# Altium schematic sheet interlock.SchDoc
size A3; DocumentNumber: 14; SheetNumber: 14; SheetTotal: 45; SheetDescription: Interlock Circuit
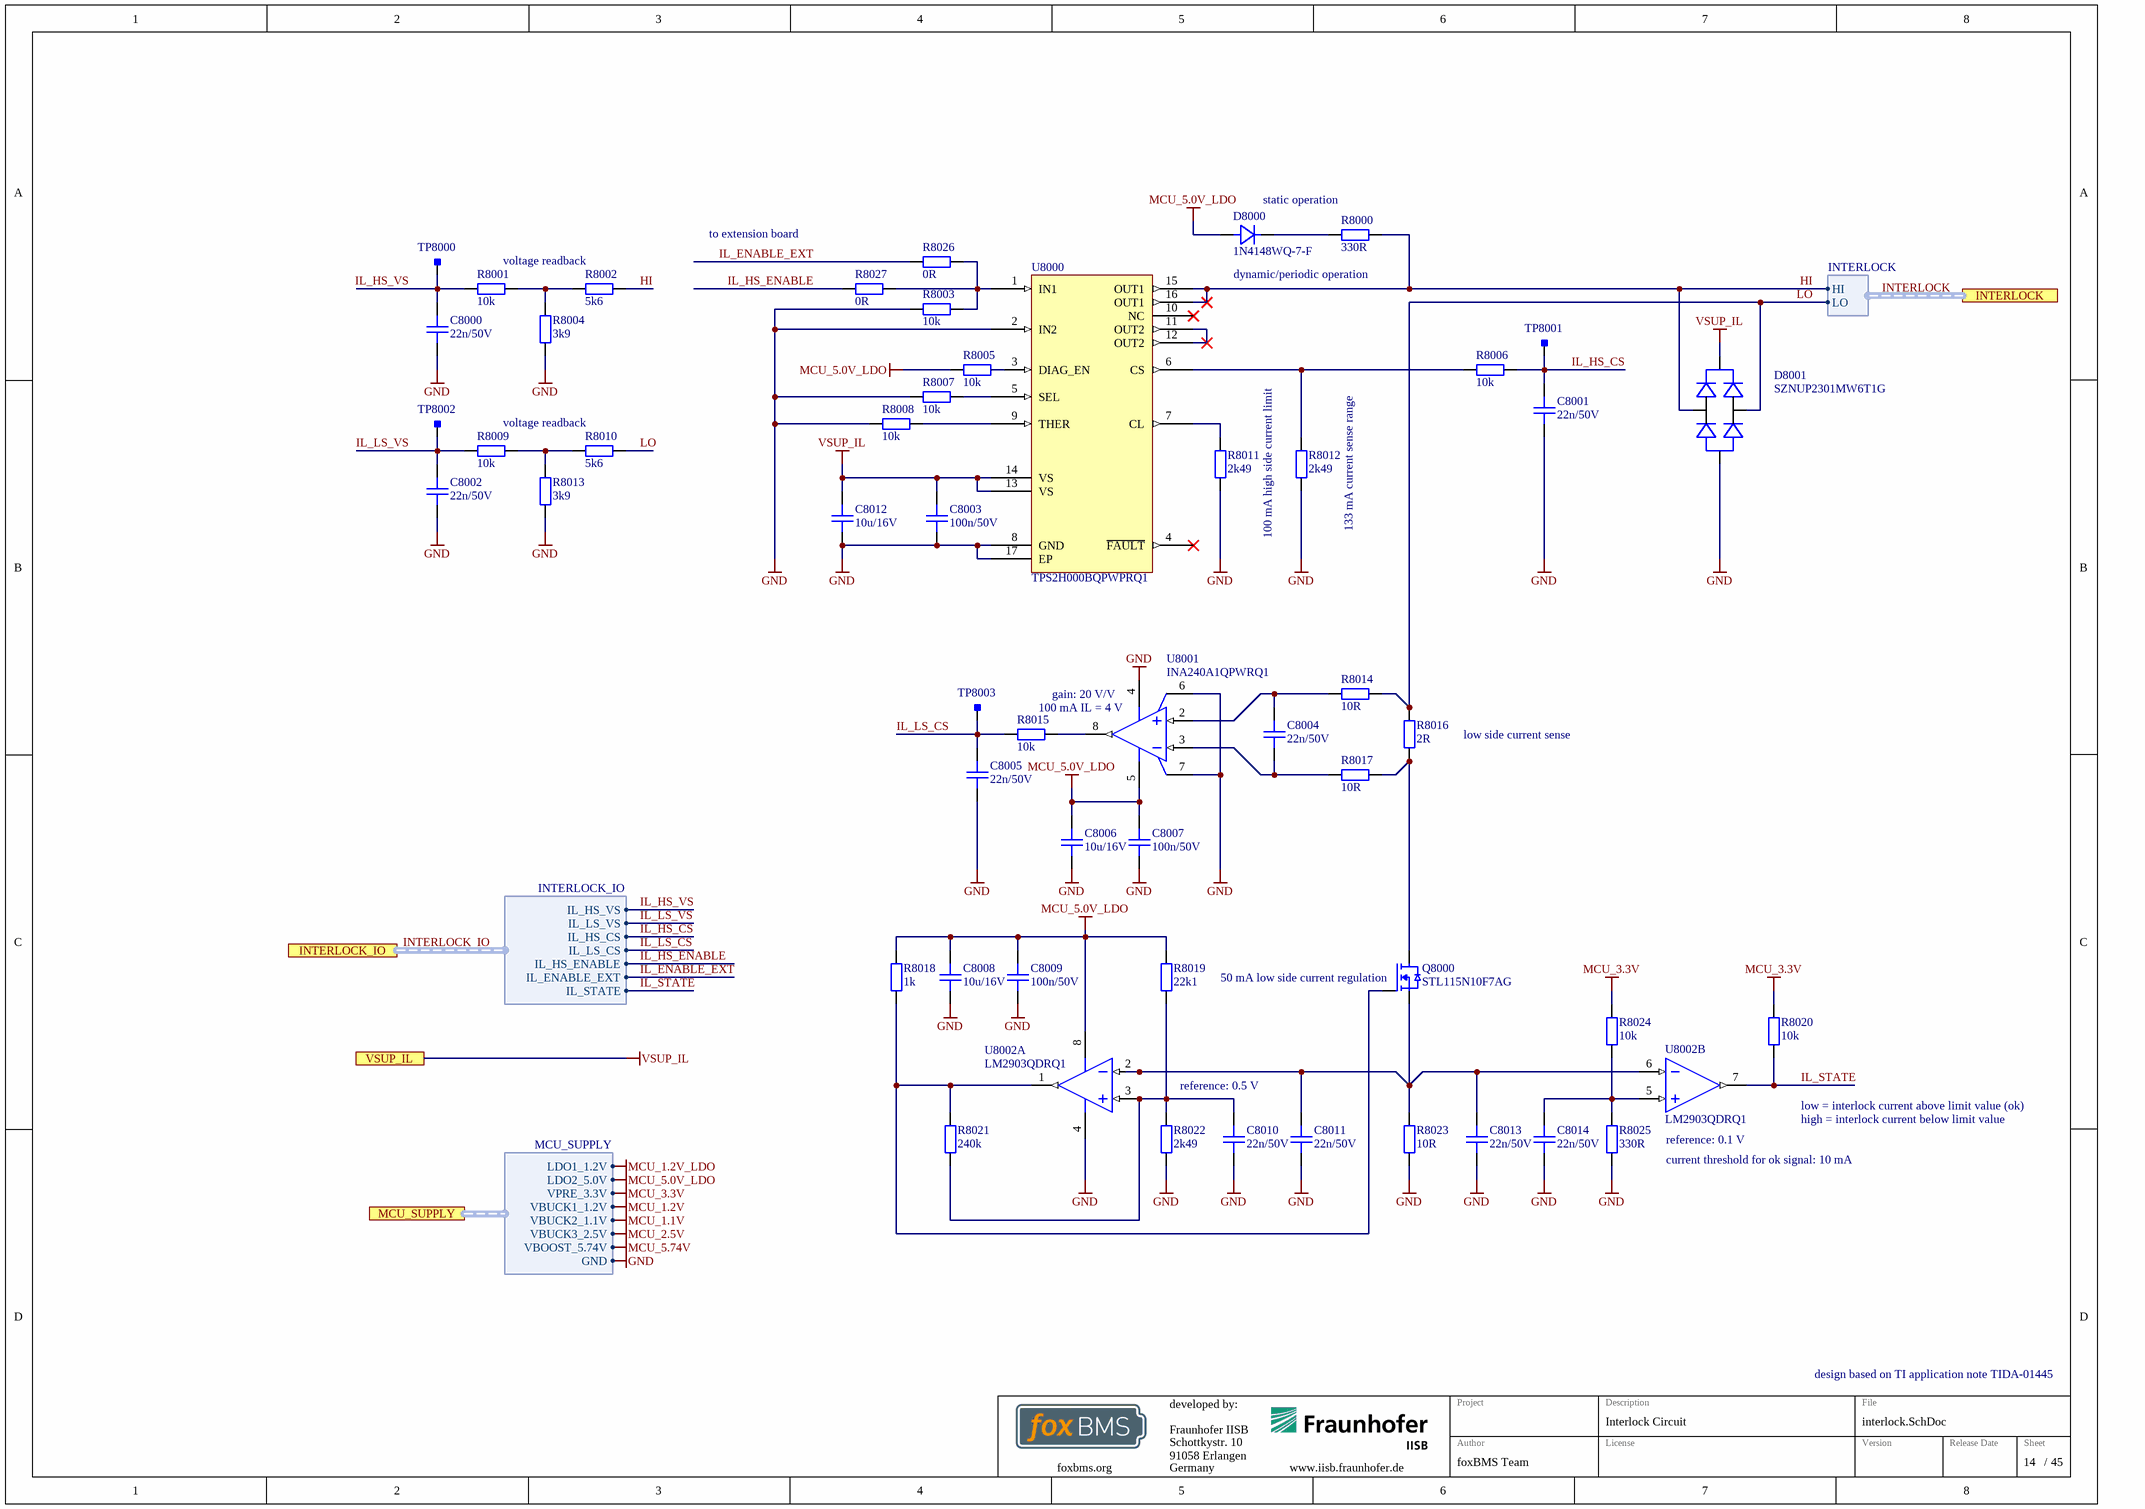
[diagram p0: interlock.SchDoc]

## Parts
C8000  22n/50V  [CAPC1005X06N]
C8001  22n/50V  [CAPC1005X06N]
C8002  22n/50V  [CAPC1005X06N]
C8003  100n/50V  [CAPC1005X06N]
C8004  22n/50V  [CAPC1005X06N]
C8005  22n/50V  [CAPC1005X06N]
C8006  10u/16V  [CAPC2012X14N]
C8007  100n/50V  [CAPC1005X06N]
C8008  10u/16V  [CAPC2012X14N]
C8009  100n/50V  [CAPC1005X06N]
C8010  22n/50V  [CAPC1005X06N]
C8011  22n/50V  [CAPC1005X06N]
C8012  10u/16V  [CAPC2012X14N]
C8013  22n/50V  [CAPC1005X06N]
C8014  22n/50V  [CAPC1005X06N]
D8000  1N4148WQ-7-F  [SOD-123_CASE-425-04-ISSUE-G]
D8001  SZNUP2301MW6T1G  [ONSEMI_SC-88_SOT-363]
Q8000  STL115N10F7AG  [ST_PowerFLAT_5x6_WF_type_C]
R8000  330R  [RESC1608X05N]
R8001  10k  [RESC1005X04N]
R8002  5k6  [RESC1005X04N]
R8003  10k  [RESC1005X04N]
R8004  3k9  [RESC1005X04N]
R8005  10k  [RESC1005X04N]
R8006  10k  [RESC1005X04N]
R8007  10k  [RESC1005X04N]
R8008  10k  [RESC1005X04N]
R8009  10k  [RESC1005X04N]
R8010  5k6  [RESC1005X04N]
R8011  2k49  [RESC1005X04N]
R8012  2k49  [RESC1005X04N]
R8013  3k9  [RESC1005X04N]
R8014  10R  [RESC1005X04N]
R8015  10k  [RESC1005X04N]
R8016  2R  [RESC2012X05N]
R8017  10R  [RESC1005X04N]
R8018  1k  [RESC1005X04N]
R8019  22k1  [RESC1005X04N]
R8020  10k  [RESC1005X04N]
R8021  240k  [RESC1005X04N]
R8022  2k49  [RESC1005X04N]
R8023  10R  [RESC2012X05N]
R8024  10k  [RESC1005X04N]
R8025  330R  [RESC1005X04N]
R8026  0R  [RESC1005X04N]
R8027  0R  [RESC1005X04N]
TP8000  Testpoint_Square  [Testpoint_S1]  (value not drawn)  (no BOM)
TP8001  Testpoint_Square  [Testpoint_S1]  (value not drawn)  (no BOM)
TP8002  Testpoint_Square  [Testpoint_S1]  (value not drawn)  (no BOM)
TP8003  Testpoint_Square  [Testpoint_S1]  (value not drawn)  (no BOM)
U8000  TPS2H000BQPWPRQ1  [TI_PWP0016J]
U8001  INA240A1QPWRQ1  [TI_PW0008A]
U8002  LM2903QDRQ1  [TI_D0008A]  (parts A,B of 2)

## Ports
INTERLOCK (harness INTERLOCK), INTERLOCK_IO (harness INTERLOCK_IO), MCU_SUPPLY (harness MCU_SUPPLY), VSUP_IL

## Harnesses
INTERLOCK: HI, LO
INTERLOCK_IO: IL_HS_CS, IL_LS_CS, IL_HS_VS, IL_LS_VS, IL_HS_ENABLE, IL_STATE, IL_ENABLE_EXT
MCU_SUPPLY: VBUCK1_1.2V, VBUCK2_1.1V, VBUCK3_2.5V, LDO1_1.2V, LDO2_5.0V, GND, VPRE_3.3V, VBOOST_5.74V

## Nets
GND: C8000.1 C8001.1 C8002.1 C8003.1 C8005.1 C8006.1 C8007.1 C8008.1 C8009.1 C8010.1 C8011.2 C8012.1 C8013.2 C8014.1 D8001.1(Anode) R8003.2 R8004.1 R8007.2 R8008.2 R8011.2 R8012.2 R8013.1 R8022.1 R8023.2 R8025.1 U8000.2(IN2) U8000.8(GND) U8000.17(EP) U8001.4(-VS) U8001.6(REF2) U8001.7(REF1) U8002.4(GND) ; port MCU_SUPPLY.GND
MCU_1.1V: port MCU_SUPPLY.VBUCK2_1.1V
MCU_1.2V: port MCU_SUPPLY.VBUCK1_1.2V
MCU_1.2V_LDO: port MCU_SUPPLY.LDO1_1.2V
MCU_2.5V: port MCU_SUPPLY.VBUCK3_2.5V
MCU_3.3V: R8020.1 R8024.1 ; port MCU_SUPPLY.VPRE_3.3V
MCU_5.0V_LDO: C8006.2 C8007.2 C8008.2 C8009.2 D8000.2(A) R8005.2 R8018.2 R8019.1 U8001.5(+VS) U8002.8(VCC) ; port MCU_SUPPLY.LDO2_5.0V
MCU_5.74V: port MCU_SUPPLY.VBOOST_5.74V
VSUP_IL: C8003.2 C8012.2 D8001.3(Cathode) U8000.13(VS) U8000.14(VS) ; port VSUP_IL
HI: D8001.2(Common) R8000.1 R8002.2 U8000.15(OUT1) U8000.16(OUT1) ; port INTERLOCK.HI
IL_ENABLE_EXT: R8026.1 ; port INTERLOCK_IO.IL_ENABLE_EXT
IL_HS_CS: C8001.2 R8006.1 TP8001.1 ; port INTERLOCK_IO.IL_HS_CS
IL_HS_ENABLE: R8027.1 ; port INTERLOCK_IO.IL_HS_ENABLE
IL_HS_VS: C8000.2 R8001.1 TP8000.1 ; port INTERLOCK_IO.IL_HS_VS
IL_LS_CS: C8005.2 R8015.1 TP8003.1 ; port INTERLOCK_IO.IL_LS_CS
IL_LS_VS: C8002.2 R8009.1 TP8002.1 ; port INTERLOCK_IO.IL_LS_VS
IL_STATE: R8020.2 U8002.7(2OUT) ; port INTERLOCK_IO.IL_STATE
LO: D8001.5(Common) R8010.2 R8014.2 R8016.1 ; port INTERLOCK.LO  [project net INTERLOCK.LO]
NetC8004_1: C8004.1 R8017.1 U8001.3(-IN)
NetC8004_2: C8004.2 R8014.1 U8001.2(+IN)
NetC8010_2: C8010.2 R8019.2 R8021.1 R8022.2 U8002.3(1IN+)
NetC8011_1: C8011.1 C8013.1 Q8000.S R8023.1 U8002.2(1IN-) U8002.6(2IN-)
NetC8014_2: C8014.2 R8024.2 R8025.2 U8002.5(2IN+)
NetD8000_1: D8000.1(K) R8000.2
NetQ8000_D: Q8000.D R8016.2 R8017.2
NetQ8000_G: Q8000.G R8018.1 R8021.2 U8002.1(1OUT)
NetR8001_2: R8001.2 R8002.1 R8004.2
NetR8003_1: R8003.1 R8026.2 R8027.2 U8000.1(IN1)
NetR8005_1: R8005.1 U8000.3(DIAG_EN)
NetR8006_2: R8006.2 R8012.1 U8000.6(CS)
NetR8007_1: R8007.1 U8000.5(SEL)
NetR8008_1: R8008.1 U8000.9(THER)
NetR8009_2: R8009.2 R8010.1 R8013.2
NetR8011_1: R8011.1 U8000.7(CL)
NetR8015_2: R8015.2 U8001.8(VOUT)
NetU8000_11: U8000.11(OUT2) U8000.12(OUT2)

Not connected (* = marked no-connect by the designer): U8000 4(~{FAULT})* 10(NC)*

## Buses and harness runs
harness INTERLOCK = port INTERLOCK
harness INTERLOCK_IO = port INTERLOCK_IO

## Notes on the sheet
- to extension board
- static operation
- voltage readback
- dynamic/periodic operation
- 100 mA high side current limit
- (near R8012) 133 mA current sense range
- (near U8001) 100 mA IL = 4 V
- (near U8001) gain: 20 V/V
- low side current sense
- (near Q8000) 50 mA low side current regulation
- reference: 0.5 V
- low = interlock current above limit value (ok)
- high = interlock current below limit value
- reference: 0.1 V
- current threshold for ok signal: 10 mA
- design based on TI application note TIDA-01445
- Fraunhofer IISB
- Schottkystr. 10
- developed by:
- 91058 Erlangen
- Germany
- Author
- Project
- License
- Description
- File
- Version
- Release Date
- Sheet
- foxbms.org <https://foxbms.org>
- www.iisb.fraunhofer.de <https://www.iisb.fraunhofer.de/>
- foxBMS Team
- /

## Library data of the parts
C8000-C8002 C8004 C8005 C8010 C8011 C8013 C8014 = gen_C_ceramic_22n_50V_X7R_0402: MLCC; Capacitance: 22n; Rated Voltage: 50V; Dielectric: X7R; Case EIA: 0402; Case Metric: 1005; Automotive Qualified: True; AEC-Q Norm: AEC-Q200; AEC-Q Grade: Grade 1; PnP Package: 0402C; Part Number: gen_C_ceramic_22n_50V_X7R_0402; Supplier 1: Digikey; Supplier Part Number 1: 490-4763-1-ND; ECCN: EAR99
C8003 C8007 C8009 = gen_C_ceramic_100n_50V_X7R_0402: MLCC; Capacitance: 100n; Rated Voltage: 50V; Dielectric: X7R; Case EIA: 0402; Case Metric: 1005; PnP Package: 0402C; PnP Value: 100nF/50V/X7R; PnP equipped: x; Automotive Qualified: True; AEC-Q Norm: AEC-Q200; Part Number: gen_C_ceramic_100n_50V_X7R_0402; Supplier 1: Farnell; Supplier Part Number 1: 2210822; ECCN: EAR99
C8006 C8008 C8012 = gen_C_ceramic_10u_16V_X7R_0805: MLCC; Capacitance: 10u; Rated Voltage: 16V; Dielectric: X7S; Case EIA: 0805; Case Metric: 2012; Automotive Qualified: True; AEC-Q Grade: Grade 1; AEC-Q Norm: AEC-Q200; Part Number: gen_C_ceramic_10u_16V_X7R_0805; ECCN: EAR99; Supplier 1: Digikey; Supplier Part Number 1: 445-16110-1-ND
D8000 = 1N4148WQ-7-F: Diode; Manufacturer: Diodes Inc.; Breakdown Voltage: 100V; Continuous Forward Current: 300mA; PnP Package: SOD123; Automotive Qualified: True; Part Number: 1N4148WQ-7-F; Part Name: 1N4148WQ-7-F; Operating Temperature: -65°C - +150°C; ComponentLink1Description: Datasheet; ComponentLink1URL: https://www.diodes.com/assets/Datasheets/ds30086.pdf; Supplier 1: Digikey; Supplier Part Number 1: 1N4148WQ-7-FDICT-ND
D8001 = SZNUP2301MW6T1G: TVS diode array; Manufacturer: ON Semiconductor; Breakdown Voltage: 70V; Automotive Qualified: True; AEC-Q Norm: AEC-Q101; AEC-Q Grade: Grade 0; Part Number: SZNUP2301MW6T1G; Part Name: SZNUP2301MW6T1G; Operating Temperature: -55°C - +150°C; ComponentLink1Description: Datasheet; ComponentLink1URL: https://www.mouser.de/datasheet/2/308/1/NUP2301MW6T1_D-2319422.pdf; Supplier 1: Mouser; Supplier Part Number 1: 863-SZNUP2301MW6T1G; ECCN: EAR99
Q8000 = STL115N10F7AG: N-Channel MOSFET, 100 V, 107 A, 5 mOhm; Manufacturer: STMicroelectronics; Maximum Drain-Source Voltage: 100V; Maximum Continous Drain Current (25°C): 107A; R_DS(on): 5m; Total Gate Charge: 72.5nC; Automotive Qualified: True; AEC-Q Norm: AEC-Q101; AEC-Q Grade: Grade 0; Part Number: STL115N10F7AG; Part Name: NMOS; Operating Temperature: -55°C - +175°C; ComponentLink1Description: Datasheet; ComponentLink1URL: https://www.mouser.de/datasheet/2/389/dm00333356-1798814.pdf; Supplier 1: Mouser; Supplier Part Number 1: 511-STL115N10F7AG; Supplier 2: Digikey; Supplier Part Number 2: 497-17622-1-ND; ECCN: EAR99
R8000 = gen_R_330R_0603: SMD Resistor 330R 0603; Power: 0.1W; Case EIA: 0603; Case Metric: 1608; Maximum Working Voltage: 75V; PnP Package: 0603R; Automotive Qualified: True; Tolerance: 1%; Part Number: gen_R_330R_0603; Operating Temperature: -55°C - +155°C; Resistance: 330R; Series: E24; PnP Value: 330R; Supplier 1: Farnell; Supplier Part Number 1: 2692155
R8001 R8003 R8005-R8009 R8015 R8020 R8024 = gen_R_10k_0402: SMD Resistor 10k 0402; Power: 0.063W; Case EIA: 0402; Case Metric: 1005; Maximum Working Voltage: 50V; PnP Package: 0402R; Automotive Qualified: True; Tolerance: 1%; PnP equipped: x; AEC-Q Norm: AEC-Q200; Part Number: gen_R_10k_0402; Operating Temperature: -55°C - +155°C; Resistance: 10k; Series: E24, E96; PnP Value: 10k; Supplier 1: Farnell; Supplier Part Number 1: 2059239; ECCN: EAR99
R8002 R8010 = gen_R_5k6_0402: SMD Resistor 5k6 0402; Power: 0.063W; Case EIA: 0402; Case Metric: 1005; Maximum Working Voltage: 50V; PnP Package: 0402R; Automotive Qualified: True; Tolerance: 1%; AEC-Q Norm: AEC-Q200; AEC-Q Grade: Grade 0; Part Number: gen_R_5k6_0402; Operating Temperature: -55°C - +155°C; Resistance: 5k6; Series: E24; PnP Value: 5k6; Supplier 1: Digikey; Supplier Part Number 1: A129636CT-ND; ECCN: EAR99
R8004 R8013 = gen_R_3k9_0402: SMD Resistor 3k9 0402; Power: 0.063W; Case EIA: 0402; Case Metric: 1005; Maximum Working Voltage: 50V; PnP Package: 0402R; Automotive Qualified: True; Tolerance: 1%; AEC-Q Grade: Grade 0; AEC-Q Norm: AEC-Q200; Part Number: gen_R_3k9_0402; Operating Temperature: -55°C - +155°C; Resistance: 3k9; Series: E24; PnP Value: 3k9; ECCN: EAR99; Supplier 1: Farnell; Supplier Part Number 1: 2302698
R8011 R8012 R8022 = gen_R_2k49_0402: SMD Resistor 2k49 0402; Power: 0.063W; Case EIA: 0402; Case Metric: 1005; Maximum Working Voltage: 50V; PnP Package: 0402R; Automotive Qualified: True; Tolerance: 1%; Part Number: gen_R_2k49_0402; Operating Temperature: -55°C - +155°C; Resistance: 2k49; Series: E96; PnP Value: 2k49; Supplier 1: Farnell; Supplier Part Number 1: 2059135
R8014 R8017 = gen_R_10R_0402: SMD Resistor 10R 0402; Power: 0.063W; Case EIA: 0402; Case Metric: 1005; Maximum Working Voltage: 50V; PnP Package: 0402R; Automotive Qualified: True; Tolerance: 1%; Part Number: gen_R_10R_0402; Operating Temperature: -55°C - +155°C; Resistance: 10R; Series: E24, E96; PnP Value: 10R; Supplier 1: Farnell; Supplier Part Number 1: 2302417
R8016 = gen_R_2R_0805: SMD Resistor 2R 0805; Power: 0.125W; Case EIA: 0805; Case Metric: 2012; Maximum Working Voltage: 150V; PnP Package: 0805R; Automotive Qualified: True; Tolerance: 1%; AEC-Q Grade: Grade 0; AEC-Q Norm: AEC-Q200; Part Number: gen_R_2R_0805; Operating Temperature: -55°C - +155°C; Resistance: 2R; Series: E24, E96; PnP Value: 2R; ECCN: EAR99; Supplier 1: Digikey; Supplier Part Number 1: P19275CT-ND
R8018 = gen_R_1k_0402: SMD Resistor 1k 0402; Power: 0.063W; Case EIA: 0402; Case Metric: 1005; Maximum Working Voltage: 50V; PnP Package: 0402R; Automotive Qualified: True; Tolerance: 1%; PnP equipped: x; AEC-Q Norm: AEC-Q200; Part Number: gen_R_1k_0402; Operating Temperature: -55°C - +155°C; Resistance: 1k; Series: E24, E96; PnP Value: 1k; Supplier 1: Farnell; Supplier Part Number 1: 2302638; ECCN: EAR99
R8019 = gen_R_22k1_0402: SMD Resistor 22k1 0402; Power: 0.063W; Case EIA: 0402; Case Metric: 1005; Maximum Working Voltage: 50V; PnP Package: 0402R; Automotive Qualified: True; Tolerance: 1%; AEC-Q Norm: AEC-Q200; AEC-Q Grade: Grade 0; Part Number: gen_R_22k1_0402; Operating Temperature: -55°C - +155°C; Resistance: 22k1; Series: E96; PnP Value: 22k1; ECCN: EAR99; Supplier 1: Farnell; Supplier Part Number 1: 2563485
R8021 = gen_R_240k_0402: SMD Resistor 240k 0402; Power: 0.063W; Case EIA: 0402; Case Metric: 1005; Maximum Working Voltage: 50V; PnP Package: 0402R; Automotive Qualified: True; Tolerance: 1%; AEC-Q Norm: AEC-Q200; AEC-Q Grade: Grade 0; Part Number: gen_R_240k_0402; Operating Temperature: -55°C - +155°C; Resistance: 240k; Series: E24; PnP Value: 240k; Supplier 1: Digikey; Supplier Part Number 1: P240KLCT-ND; ECCN: EAR99
R8023 = gen_R_10R_0805: SMD Resistor 10R 0805; Power: 0.125W; Case EIA: 0805; Case Metric: 2012; Maximum Working Voltage: 150V; PnP Package: 0805R; Automotive Qualified: True; Tolerance: 1%; AEC-Q Grade: Grade 0; AEC-Q Norm: AEC-Q200; Part Number: gen_R_10R_0805; Operating Temperature: -55°C - +155°C; Resistance: 10R; Series: E24, E96; PnP Value: 10R; ECCN: EAR99; Supplier 1: Farnell; Supplier Part Number 1: 1750728
R8025 = gen_R_330R_0402: SMD Resistor 330R 0402; Power: 0.063W; Case EIA: 0402; Case Metric: 1005; Maximum Working Voltage: 50V; PnP Package: 0402R; Automotive Qualified: True; Tolerance: 1%; AEC-Q Grade: Grade 0; AEC-Q Norm: AEC-Q200; Part Number: gen_R_330R_0402; Operating Temperature: -55°C - +155°C; Resistance: 330R; Series: E24; PnP Value: 330R; ECCN: EAR99; Supplier 1: Farnell; Supplier Part Number 1: 2302581
R8026 R8027 = gen_R_0R_0402: SMD Resistor 0R 0402; Power: 0.063W; Case EIA: 0402; Case Metric: 1005; Maximum Working Voltage: 50V; PnP Package: 0402R; Automotive Qualified: True; AEC-Q Norm: AEC-Q200; PnP equipped: x; Part Number: gen_R_0R_0402; Operating Temperature: -55°C - +155°C; Resistance: 0R; Series: Jumper; PnP Value: 0R; Supplier 1: Farnell; Supplier Part Number 1: 1469661; Supplier 2: Farnell; Supplier Part Number 2: 2059190; ECCN: EAR99
TP8000-TP8003 = Testpoint_Square: Testpoint, square; Automotive Qualified: False; Part Number: Testpoint_Square
U8000 = TPS2H000BQPWPRQ1: 1000-mΩ Dual-Channel SmartHigh-Side Power Switch; Manufacturer: Texas Instruments; Automotive Qualified: True; AEC-Q Norm: AEC-Q100; AEC-Q Grade: Grade 1; Part Number: TPS2H000BQPWPRQ1; Part Name: TPS2H000BQPWPRQ1; Operating Temperature: −40°C - +125°C; ComponentLink1Description: Datasheet; ComponentLink1URL: http://www.ti.com/lit/ds/symlink/tps2h000-q1.pdf; Supplier 1: Mouser; Supplier Part Number 1: 595-TPS2H000BQPWPRQ1; Supplier 2: Digikey; Supplier Part Number 2: 296-45179-1-ND; Supplier 3: Farnell; Supplier Part Number 3: 3124090; ECCN: EAR99
U8001 = INA240A1QPWRQ1: Automotive, Wide Common-Mode Range, High- and Low-Side, Bidirectional, Zero-Drift, Current-Sense Amplifier With Enhanced PWM Rejection; Manufacturer: Texas Instruments; Amplifier Type: Instrumentation; Number of Circuits: 1; Slew Rate: 35V/µs; Mfg Application Notes: WaterAnalysisSolutionforpH&ConductivityMeters; Current - Supply: 2mA; Voltage - Supply, Single/Dual (±): 5V~36V,±2.5V~18V; Current - Input Bias: 1nA; Product Training Modules: CommonPhotodiodeOp-AmpCircuitProblemsandSolutionsIndirectCurrentFeedbackInstrumentationAmplifierApplicationsGuide; Voltage - Input Offset: 60µV; Featured Product: AD8421InstrumentationAmplifier; EDA / CAD Models: DownloadfromAcceleratedDesigns; -3db Bandwidth: 10MHz; Package Version: 10/2009; Current - Output / Channel: 65mA; Automotive Qualified: True; AEC-Q Norm: AEC-Q100; AEC-Q Grade: Grade 1; Series: -; Category: IntegratedCircuits(ICs); Output Type: -; Package Reference: RM-8; Datasheet Version: Rev. 0, 05/2012; Family: Linear-Amplifiers-Instrumentation,OPAmps,BufferAmps; Packaging: Tube; Standard Package: 50; Online Catalog: Instrumentation; Operating Temperature: −40°C - +125°C; Package Description: 8-Pin Mini Small Outline Package, Body 3 x 3 mm, Pitch 0.65 mm; Package / Case: 8-TSSOP,8-MSOP(0.118",3.00mmWidth); Mounting Technology: SurfaceMount; Manufacturer URL: http://www.analog.com/; Mounting Type: SurfaceMount; Datasheet URL: http://www.analog.com/media/en/technical-documentation/data-sheets/AD8421.pdf; Gain Bandwidth Product: -; Supplier Device Package: 8-MSOP; Package URL: http://www.analog.com/static/imported-files/packages/PKG_PDF/MSOP%28RM%29/RM_8.pdf; Part Number: INA240A1QPWRQ1; Part Name: INA240A1QPWRQ1; ComponentLink1Description: Datasheet; ComponentLink1URL: http://www.ti.com/lit/ds/symlink/ina240-q1.pdf; Supplier 1: Mouser; Supplier Part Number 1: 595-INA240A1QPWRQ1; Supplier 2: Digikey; Supplier Part Number 2: 296-50472-1-ND; ECCN: EAR99
U8002 = LM2903QDRQ1: Automotive Dual Comparators; Manufacturer: Texas Instruments; Automotive Qualified: True; AEC-Q Norm: AEC-Q100; AEC-Q Grade: Grade 1; Part Number: LM2903QDRQ1; Part Name: LM2903QDRQ1; Operating Temperature: −40°C - +125°C; ComponentLink1Description: Datasheet; ComponentLink1URL: http://www.ti.com/lit/ds/symlink/lm2903-q1.pdf; Supplier 1: Mouser; Supplier Part Number 1: 595-LM2903QDRQ1; Supplier 2: Digikey; Supplier Part Number 2: 296-15183-1-ND; ECCN: EAR99